# EAGLE design P4-1-17 (EAGLE 9.6.0)
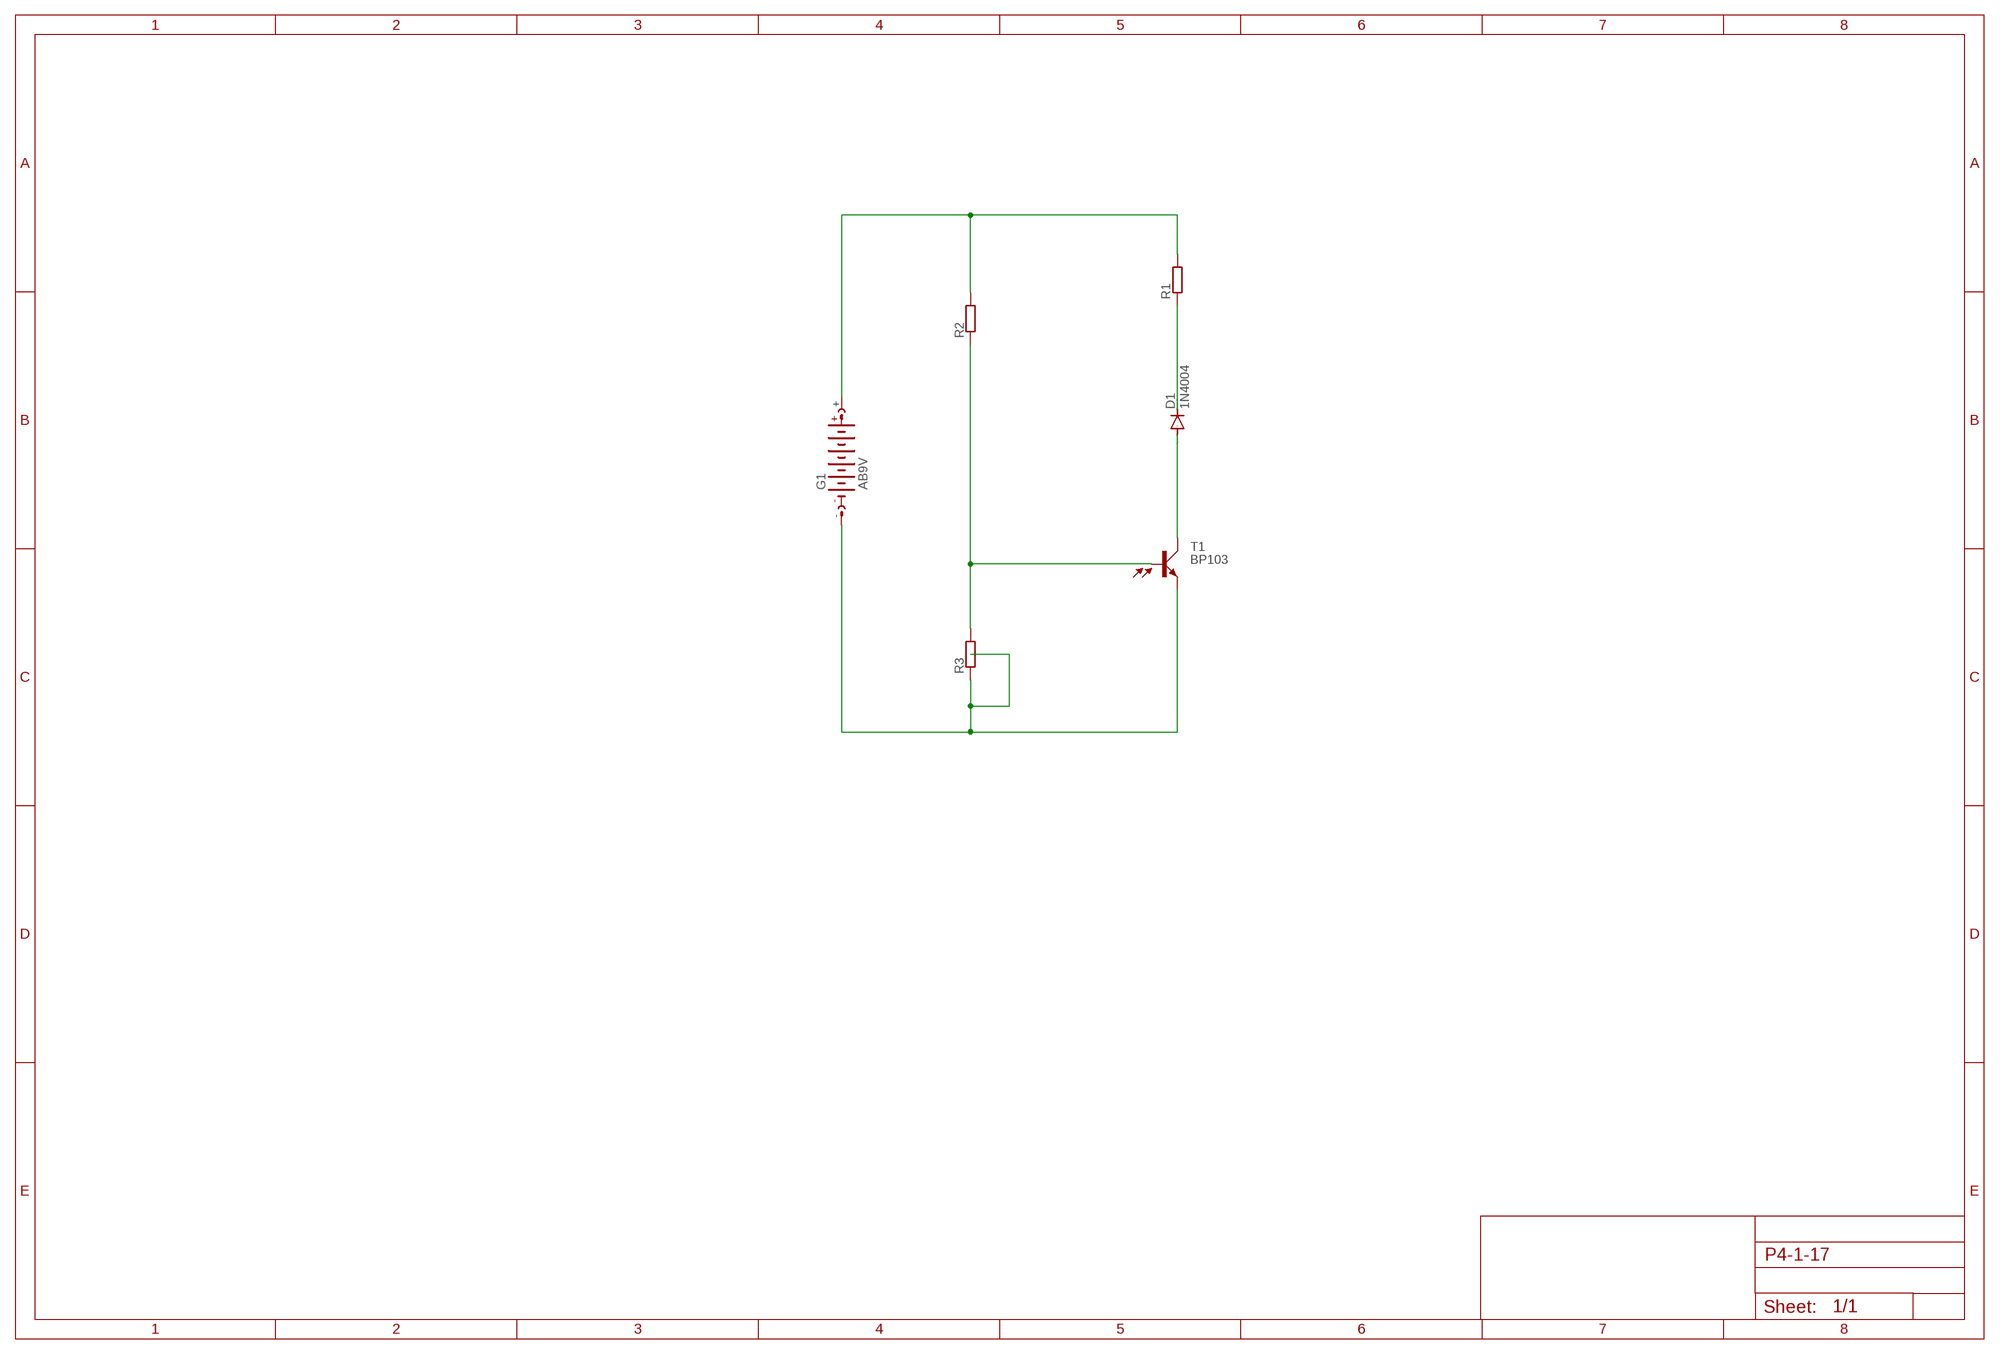
[diagram p0: schematic, sheet 1]

## Parts
D1  1N4004  [DO41-10]
G1  AB9V  [AB9V]
R1  BVS  [BVS]
R2  BVS  [BVS]
R3  BVS  [BVS]
T1  BP103  [BP103]

## Nets
N$1: G1.- R3.2 T1.E
N$2: R2.2 R3.1 T1.B
N$4: D1.A T1.C
N$5: D1.C R1.2
N$6: G1.+ R1.1 R2.1

## Library data of the parts
D1 = diode:1N4004: DIODE general purpose rectifier, 1 A
G1 = battery:AB9V: 9-V BATTERY CLIP
R1-R3 = resistor-shunt:BVS: SMD SHUNT RESISTOR; OC_FARNELL: unknown; OC_NEWARK: unknown
T1 = opto-trans-siemens:BP103: PHOTO TRANSISTOR; OC_FARNELL: unknown; OC_NEWARK: unknown

## Board
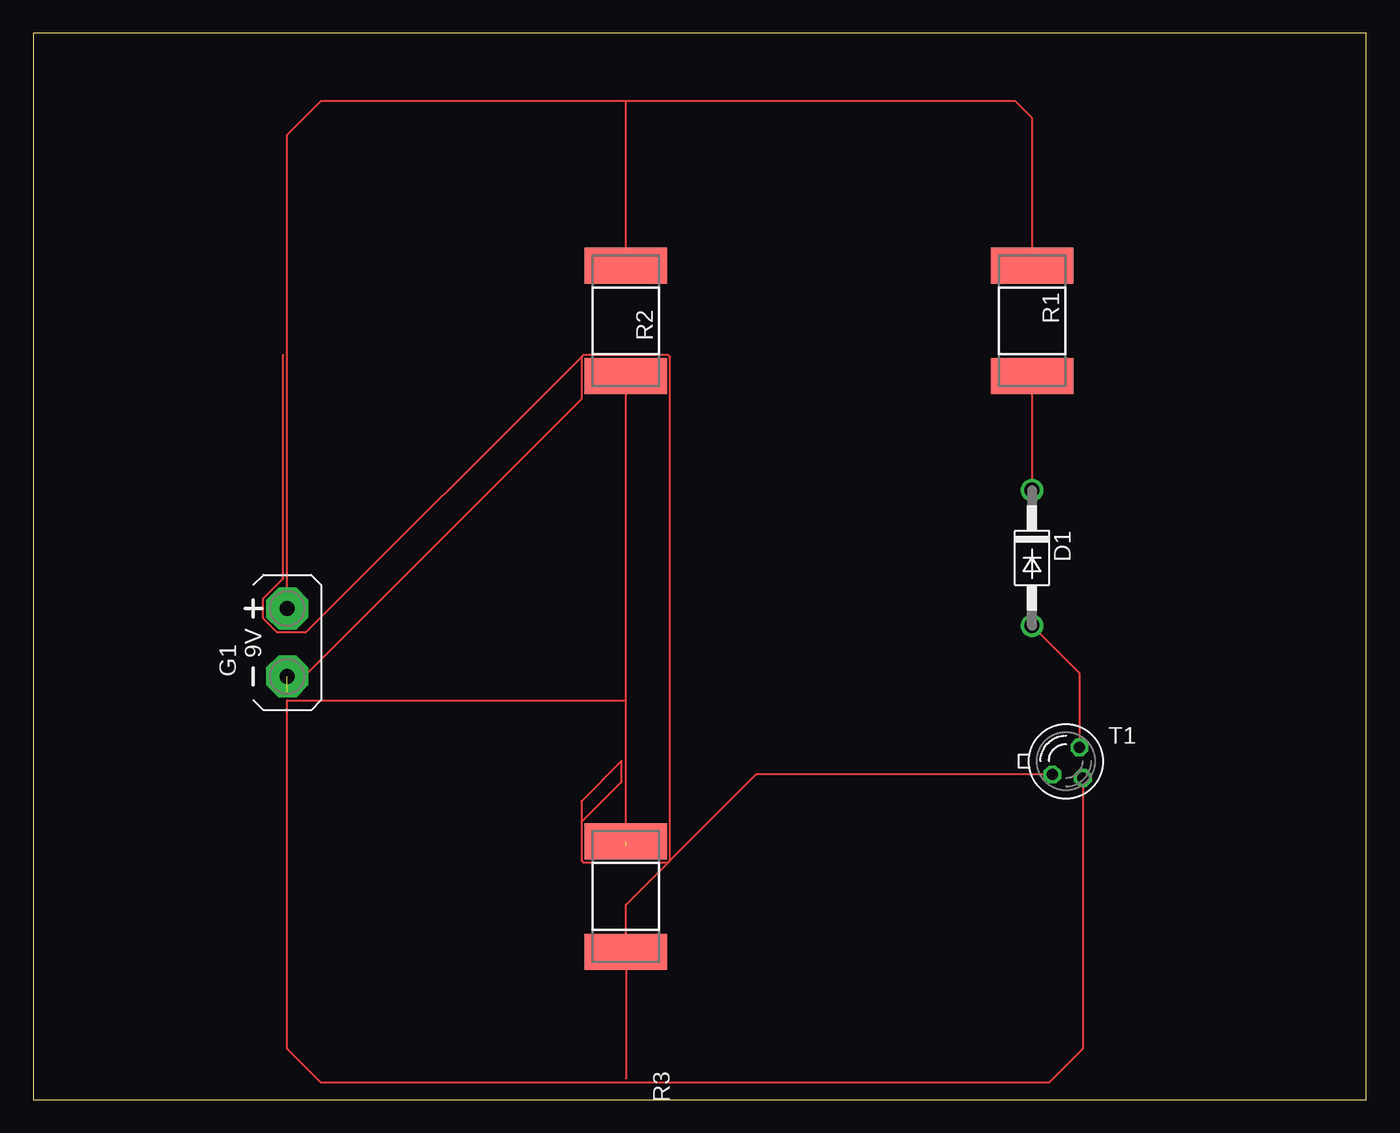
[diagram p1: board, top side]

Size 100 x 80 mm. Coordinates in mm from the lower left corner, seen from the top.
Outline: 0,0 100,0 100,80 0,80 0,0
Copper layers (1*16): Top 0.035mm / dielectric 1.5mm / Bottom 0.035mm
Design rules "default": minimum track width 6mil, minimum drill 0.35mm, track to track 6mil, track to pad 6mil, pad to pad 6mil, via to via 6mil, smd to smd 6mil, copper to edge 40mil, drill to drill 6mil, minimum pad ring 10mil, minimum via ring 8mil, stop-mask expansion 4mil, vias tented up to drill 0mil, thermal gap 10mil

### Footprints (pad centres in the part's own frame; a part is rotated, then mirrored left to right if it is on the bottom)
DO41-10 = drill 1.118: A 5.08,0; C -5.08,0
AB9V = drill 1.118 pad 3.15 octagon: + 0,2.54; - 0,-2.54
BVS = smd 2.7 x 6.2: 1 -4.14,0; 2 4.14,0
BP103 = drill 0.813 octagon: B 1.27,-1.27; C 1.016,1.016; E -1.016,-1.016

### Placement (x,y rotation side)
D1  74.93,40.64 270 top
G1  19.05,34.29 0 top
R1  74.93,58.42 270 top
R2  44.45,58.42 270 top
R3  44.45,15.24 270 top
T1  77.47,25.4 0 top

### Tracks (layer width: path | path; a pad name or v marks a point on that pad's centre or on a via)
N$1  (1 unrouted)
  Top 0.152: 44.45,1.57 R3.2 44.45,14.61 47.65,17.8 | 41.12,20.82 44.15,23.85 44.15,25.4 41.12,22.38 41.12,20.82 | T1.E 54.23,24.38 47.78,17.94 | 41.12,20.82 41.12,17.94 41.26,17.8 47.65,17.8 | 41.12,55.72 41.26,55.86 47.65,55.86 47.78,55.72 47.78,17.94 | 19.05,30.48 41.12,52.55 41.12,55.72 | 47.65,17.8 47.78,17.94 | 18.75,55.88 18.75,39.08 17.25,37.58 17.25,36.08 18.3,35.03 20.42,35.03 41.12,55.72
N$2  (1 unrouted)
  Top 0.152: T1.B 78.74,3.81 76.2,1.27 21.59,1.27 19.05,3.81 19.05,29.95 44.45,29.95 | 44.45,19.05 44.45,29.95 | 44.45,29.95 R2.2
N$4
  Top 0.152: D1.A 78.49,32 T1.C
N$5  (1 unrouted)
  Top 0.152: R1.2 74.93,44.45
N$6
  Top 0.152: G1.+ 19.05,72.39 21.59,74.93 44.45,74.93 | R1.1 74.93,73.66 73.66,74.93 44.45,74.93 | R2.1 44.45,74.93